# EAGLE design Round_Paws (EAGLE 9.6.0)
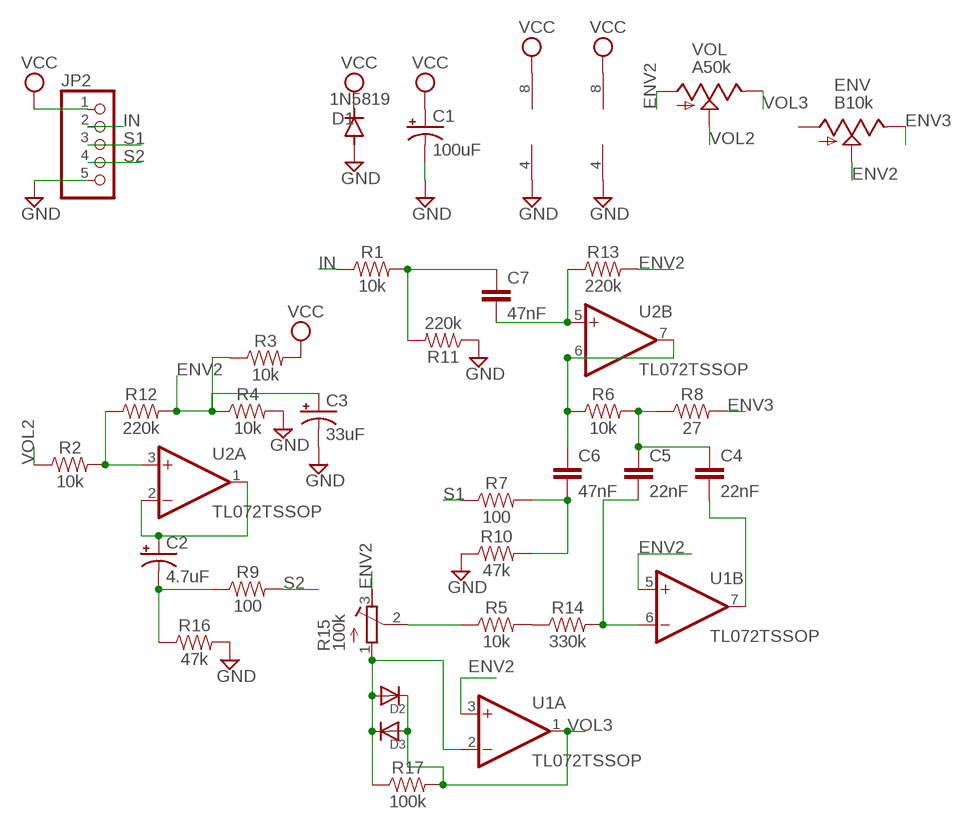
[diagram p0: schematic, sheet 1]

## Parts
C1  100uF  CAP_SMD+THRUPAN_B  [PAN_B_SMD+THRU]
C2  4.7uF  CAP_SMD+THRUPAN_B  [PAN_B_SMD+THRU]
C3  33uF  CAP_SMD+THRUPAN_B  [PAN_B_SMD+THRU]
C4  22nF  22NF/22,000PF-0603-50V-10%  [0603]
C5  22nF  22NF/22,000PF-0603-50V-10%  [0603]
C6  47nF  47NF-0603-25V-5%  [0603]
C7  47nF  47NF-0603-25V-5%  [0603]
D1  1N5819  DIODE-SOD123  [SOD123]
D2  DIODESOD-123  [SOD-123]
D3  DIODESOD-123  [SOD-123]
ENV  B10k  9MM_SNAP-IN_POT_  [9MM_SNAP-IN_POT]
JP2  PINHD-1X5  [1X05]
R1  10k  10KOHM-0603-1/10W-1%  [0603]
R2  10k  10KOHM-0603-1/10W-1%  [0603]
R3  10k  10KOHM-0603-1/10W-1%  [0603]
R4  10k  10KOHM-0603-1/10W-1%  [0603]
R5  10k  10KOHM-0603-1/10W-1%  [0603]
R6  10k  10KOHM-0603-1/10W-1%  [0603]
R7  100  100OHM-0603-1/4W-5%  [0603]
R8  27  27OHM-0603-1/10W-1%  [0603]
R9  100  100OHM-0603-1/4W-5%  [0603]
R10  47k  47KOHM-0603-1/10W-1%  [0603]
R11  220k  220KOHM-0603-1/10W-1%  [0603]
R12  220k  220KOHM-0603-1/10W-1%  [0603]
R13  220k  220KOHM-0603-1/10W-1%  [0603]
R14  330k  330KOHM-0603-1/10W-1%  [0603]
R15  100k  R-TRIMM3296W  [RTRIM3296W]
R16  47k  47KOHM-0603-1/10W-1%  [0603]
R17  100k  100KOHM-0603-1/10W-1%  [0603]
U1  TL072TSSOP  [TSSOP-8]
U2  TL072TSSOP  [TSSOP-8]
VOL  A50k  9MM_SNAP-IN_POT_  [9MM_SNAP-IN_POT]

## Nets
ENV2: C3.+ C3.++(+) ENV.2(S) R3.1 R4.1 R12.2 R13.2 R15.3(E) U1.3(A:+IN) U1.5(B:+IN) VOL.1(A)
ENV3: ENV.3(E) R8.2
GND: C1.- C1.--(-) C3.- C3.--(-) D1.A JP2.5 R4.2 R10.1 R11.1 R16.2 U1.4(P:V-) U2.4(P:V-)
IN: JP2.2 R1.1
N$1: C7.1 R1.2 R11.2
N$2: C7.2 R13.1 U2.5(B:+IN)
N$3: C6.1 R6.1 U2.6(B:-IN) U2.7(B:OUT)
N$4: C4.1 C5.1 R6.2 R8.1
N$5: C6.2 R7.2 R10.2
N$6: C5.2 R14.2 U1.6(B:-IN)
N$7: R5.2 R14.1
N$8: R5.1 R15.2(S)
N$9: D2.A D3.C R15.1(A) R17.1 U1.2(A:-IN)
N$10: C4.2 U1.7(B:OUT)
N$11: R2.2 R12.1 U2.3(A:+IN)
N$12: C2.+ C2.++(+) U2.1(A:OUT) U2.2(A:-IN)
N$13: C2.- C2.--(-) R9.1 R16.1
S1: JP2.3 R7.1
S2: JP2.4 R9.2
VCC: C1.+ C1.++(+) D1.C JP2.1 R3.2 U1.8(P:V+) U2.8(P:V+)
VOL2: R2.1 VOL.2(S)
VOL3: D2.C D3.A R17.2 U1.1(A:OUT) VOL.3(E)
Unconnected: ENV.1(A)

## Library data of the parts
C1-C3 = MusicThingModular:CAP_SMD+THRU
C4 C5 = SparkFun-Capacitors:22NF/22,000PF: 0.022uF/22nF/22,000pF ceramic capacitors A capacitor is a passive two-terminal electrical component used to store electrical energy temporarily in an electric field.; PROD_ID: CAP-07885
C6 C7 = SparkFun-Capacitors:47NF: 47nF ceramic capacitors A capacitor is a passive two-terminal electrical component used to store electrical energy temporarily in an electric field.; PROD_ID: CAP-08605
D1 = diode:DIODE-: DIODE
D2 D3 = adafruit:DIODE: Diode SMADIODE - SMA Surface Mount Package 20V 1A Schottky Diode Digikey: 641-1014-6-ND DO-1N4148 - Through Hole Small Current Diode SOD-123 20V 1 A (.5mV Vf) Schottky Diode - Digikey: MBRX120TPMSCT-ND SOD-323 10V 570mA (.38mV Vf, 3ns) Schottky Diode - Digikey: ZLLS410CT-ND SOD-523 30V 30mA Schottky Diode (RB751S-40TE61) - Digikey: RB751S-40TE61CT-ND SOT23-R/W - SOT23 Package (R = Solder Paste/Reflow Ovens, W = Hand-Soldering) BAT54Film 40V 300mA - Digikey: 497-7162-1-ND
ENV VOL = MusicThingModular:9MM_SNAP-IN_POT: 9mm vertical snap-in pot, Alpha / Panasonic style
JP2 = pinhead:PINHD-1X5: PIN HEADER
R1-R6 = SparkFun-Resistors:10KOHM: 10kΩ resistor A resistor is a passive two-terminal electrical component that implements electrical resistance as a circuit element. Resistors act to reduce current flow, and, at the same time, act to lower voltage levels within circuits. - Wikipedia; PROD_ID: RES-00824
R7 R9 = SparkFun-Resistors:100OHM: 100Ω resistor A resistor is a passive two-terminal electrical component that implements electrical resistance as a circuit element. Resistors act to reduce current flow, and, at the same time, act to lower voltage levels within circuits. - Wikipedia; PROD_ID: RES-12438
R8 = SparkFun-Resistors:27OHM: 27Ω resistor A resistor is a passive two-terminal electrical component that implements electrical resistance as a circuit element. Resistors act to reduce current flow, and, at the same time, act to lower voltage levels within circuits. - Wikipedia; PROD_ID: RES-09334
R10 R16 = SparkFun-Resistors:47KOHM: 47kΩ resistor A resistor is a passive two-terminal electrical component that implements electrical resistance as a circuit element. Resistors act to reduce current flow, and, at the same time, act to lower voltage levels within circuits. - Wikipedia; PROD_ID: RES-07871
R11-R13 = SparkFun-Resistors:220KOHM: 220kΩ resistor A resistor is a passive two-terminal electrical component that implements electrical resistance as a circuit element. Resistors act to reduce current flow, and, at the same time, act to lower voltage levels within circuits. - Wikipedia; PROD_ID: RES-08969
R14 = SparkFun-Resistors:330KOHM: 330kΩ resistor A resistor is a passive two-terminal electrical component that implements electrical resistance as a circuit element. Resistors act to reduce current flow, and, at the same time, act to lower voltage levels within circuits. - Wikipedia; PROD_ID: RES-08968
R15 = resistor:R-TRIMM: Trimm resistor
R17 = SparkFun-Resistors:100KOHM: 100kΩ resistor A resistor is a passive two-terminal electrical component that implements electrical resistance as a circuit element. Resistors act to reduce current flow, and, at the same time, act to lower voltage levels within circuits. - Wikipedia; PROD_ID: RES-07828
U1 U2 = MusicThingModular:TL072: Generic Dual Op Amp

## Board
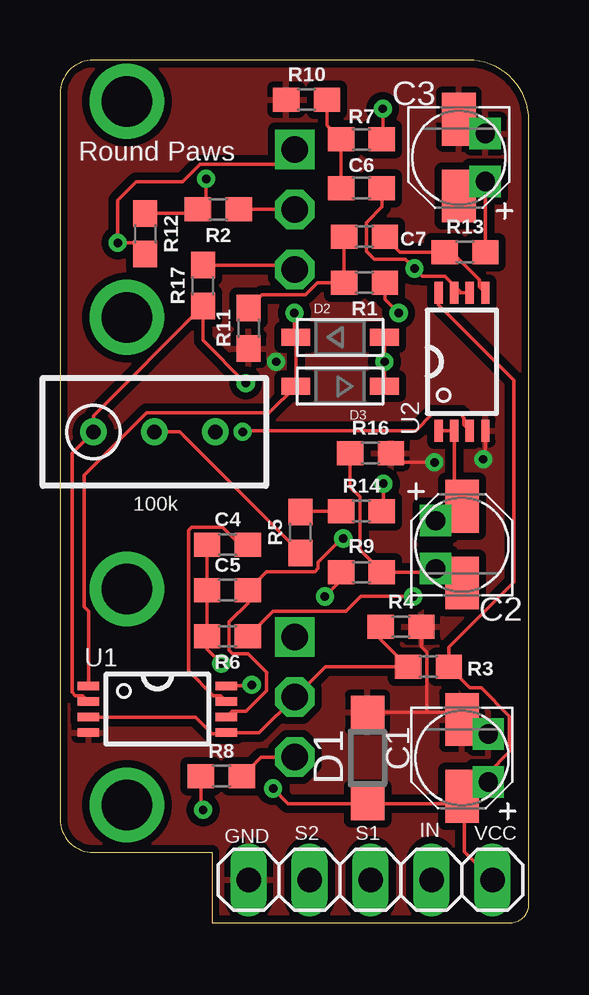
[diagram p1: board, top side]
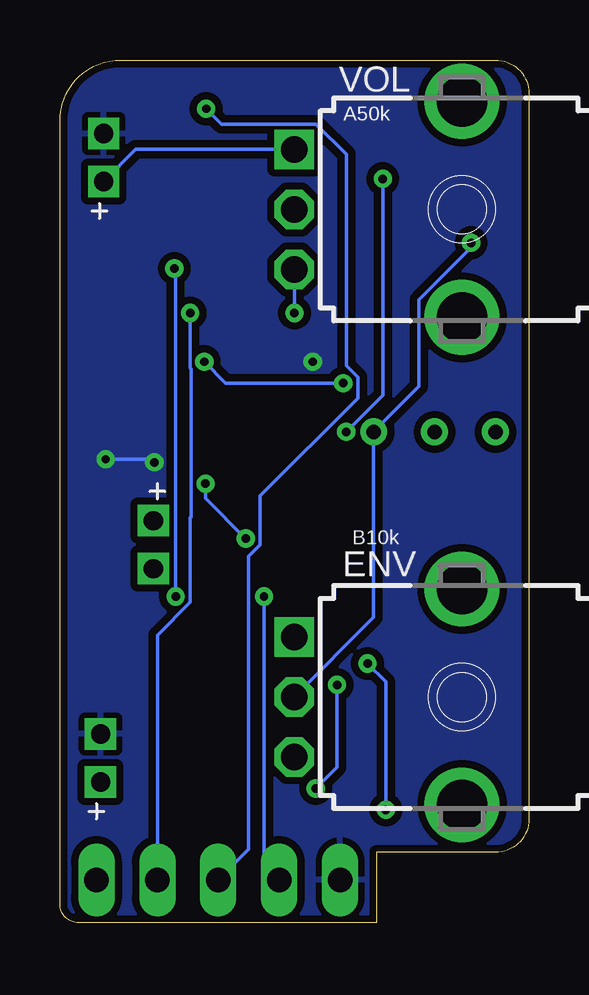
[diagram p2: board, bottom side, seen from below]

Size 19.56 x 35.94 mm. Coordinates in mm from the lower left corner, seen from the top.
Outline: 6.35,0 18.8,0 arc90 19.56,0.76 19.56,33.4 arc90 17.02,35.94 1.4,35.94 arc90 0,34.54 0,4.32 arc90 1.4,2.92 6.35,2.92 6.35,0
Copper layers (1*16): Top 0.035mm / dielectric 1.5mm / Bottom 0.035mm
Design rules "default *": minimum track width 6mil, minimum drill 0.35mm, track to track 6mil, track to pad 6mil, pad to pad 6mil, via to via 6mil, smd to smd 6mil, copper to edge 6mil, drill to drill 6mil, minimum pad ring 10mil, minimum via ring 8mil, stop-mask expansion 4mil, vias tented up to drill 0mil, thermal gap 10mil

### Footprints (pad centres in the part's own frame; a part is rotated, then mirrored left to right if it is on the bottom)
PAN_B_SMD+THRU = smd 2.2 x 1.4: + 1.6,0; - -1.6,0 | drill 0.8 pad 0.9 square: ++ 1,1.1; -- -1,1.1
0603 = smd 1.1 x 1: 1 -0.85,0; 2 0.85,0
SOD123 = smd 1.4 x 1.4: A 1.9,0; C -1.9,0
SOD-123 = smd 1.2 x 0.7: A 1.85,0; C -1.85,0
9MM_SNAP-IN_POT = drill 1.1 square: 1 -2.5,-7 | drill 1.1 octagon: 2 0,-7; 3 2.5,-7 | drill 2.1 pad 2.794: CHASSIS1 -4.5,0; CHASSIS2 4.5,0
1X05 = drill 1.016 long: 1 -5.08,0; 2 -2.54,0; 3 0,0; 4 2.54,0; 5 5.08,0
RTRIM3296W = drill 0.61: 1 0,-2.54; 2 0,0; 3 0,2.54
TSSOP-8 = smd 0.9 x 0.35: 1 -2.875,0.975; 2 -2.875,0.325; 3 -2.875,-0.325; 4 -2.875,-0.975; 5 2.875,-0.975; 6 2.875,-0.325; 7 2.875,0.325; 8 2.875,0.975

### Placement (x,y rotation side)
C1  16.76,6.86 270 top
C2  16.76,15.75 90 top
C3  16.64,31.88 270 top
C4  6.99,15.75 0 top
C5  6.99,13.84 0 top
C6  12.57,30.61 180 top
C7  12.7,28.57 0 top
D1  12.83,6.86 90 top
D2  11.68,24.38 0 top
D3  11.68,22.35 180 top
ENV  2.79,9.4 270 bottom
JP2  12.95,1.78 180 top
R1  12.7,26.67 180 top
R2  6.6,29.72 180 top
R3  15.37,10.67 0 top
R4  14.22,12.32 0 top
R5  10.03,16.26 90 top
R6  6.99,11.94 180 top
R7  12.57,32.64 180 top
R8  6.73,6.1 0 top
R9  12.57,14.61 180 top
R10  10.29,34.29 0 top
R11  7.87,24.77 90 top
R12  3.56,28.7 270 top
R13  16.89,27.94 0 top
R14  12.57,17.14 0 top
R15  3.94,20.45 270 top
R16  12.95,19.56 0 top
R17  5.97,26.54 90 top
U1  4.06,8.89 0 top
U2  16.76,23.37 90 top
VOL  2.79,29.72 270 bottom

### Tracks (layer width: path | path; a pad name or v marks a point on that pad's centre or on a via)
ENV2  (via drill 0.35)
  Top 0.152: R13.2 C3.++ 17.14,30.28 C3.+ | U1.3 5.66,8.56 6.35,7.87 6.9,7.87 U1.5 8.31,7.92 ENV.2 11.06,10.67 R3.1 13.37,11.81 R4.1 | R12.2 3.09,28.32 v2.41,28.32 2.41,30.1 3.17,30.86 5.11,30.86 5.84,31.59 9.17,31.59 VOL.1
  Bottom 0.152: VOL.1 16.4,32.22 C3.++ | v2.41,28.32 2.41,28.13 4.58,25.96 4.58,22.34 R15.3 6.48,12.71 ENV.2
ENV3
  Top 0.152: R8.2 8.38,6.9 ENV.3
GND  (via drill 0.35)
  Top 0.152: D1.A 15.37,8.76 | 15.37,8.76 16.96,8.76 C1.-- | R4.2 15.07,11.48 15.3,11.26 15.3,8.83 15.37,8.76 | v17.65,19.3 17.74,19.39 U2.4 | v15.62,19.18 14.19,19.18 R16.2
  Bottom 0.152: v15.62,19.18 15.75,19.3 v17.65,19.3
  other vias: 9.02,23.37
  pour Top (isolate 0.305): -0.64,35.94 -0.64,3.81 3.94,-0.76 19.05,-0.76 20.32,0.51 20.32,34.42 18.03,36.7 0.13,36.7
  pour Bottom (isolate 0.305): -0.64,35.94 -0.64,3.81 4.06,-0.89 18.92,-0.89 20.32,0.51 20.32,34.29 18.03,36.58 0,36.58
IN  (via drill 0.35)
  Top 0.152: v14.12,25.4 13.55,25.98 R1.1
  Bottom 0.152: JP2.2 15.49,11.97 14.12,13.34 14.12,16.86 14.1,16.89 14.1,23.07 14.14,23.12 14.14,23.62 14.12,23.64 v14.12,25.4
N$1
  Top 0.152: C7.1 R1.2 10.74,26.67 10.23,26.16 8.42,26.16 R11.2
N$2
  Top 0.152: C7.2 14.19,27.94 R13.1 16.34,27.94 17.49,26.79 17.49,26.49 U2.5
N$3  (via drill 0.35)
  Top 0.152: C6.1 13.42,29.82 12.77,29.17 12.77,27.98 13.12,27.64 14.4,27.64 v14.79,27.25 15.12,26.92 16.06,26.92 16.74,26.24 U2.6 U2.7 | v14.73,13.59 12.54,13.59 11.94,12.98 8.88,12.98 R6.1
  Bottom 0.152: v14.73,13.59 14.73,27.2 v14.79,27.25
N$4  (via drill 0.35)
  Top 0.152: C4.1 C5.1 R6.2 6.13,11.39 v6.73,10.79 | R8.1 5.88,4.79 v5.97,4.7
  Bottom 0.152: v5.97,4.7 5.97,10.03 v6.73,10.79
N$5
  Top 0.152: C6.2 R7.2 11.14,33.23 R10.2
N$6  (via drill 0.35)
  Top 0.152: U1.6 7.18,8.81 7.76,8.81 8.61,9.65 8.61,10.39 8.64,10.41 7.84,11.21 7.19,11.21 7.06,11.34 7.06,12.53 7.83,13.31 C5.2 8.62,14.63 10.63,14.63 10.76,14.76 10.76,15.02 11.75,16 v11.81,16 | v13.49,18.29 13.49,17.21 R14.2
  Bottom 0.152: v11.81,16 13.49,17.68 v13.49,18.29
N$7
  Top 0.152: R14.1 10.07,17.14 R5.2
N$8
  Top 0.152: R5.1 4.99,20.45 R15.2
N$9  (via drill 0.35)
  Top 0.152: D2.A v13.53,23.37 D3.C | U1.2 0.94,9.46 0.64,9.46 0.51,9.6 0.51,19.56 R15.1 1.4,21.12 R17.1 5.97,24.26 v7.75,22.48
  Bottom 0.152: v7.75,22.48 12.64,22.48 v13.53,23.37
N$10
  Top 0.152: U1.7 6.69,9.46 6.39,9.46 5.36,10.5 5.36,16.34 5.49,16.48 6.78,16.48 7.51,15.75 C4.2
N$11  (via drill 0.35)
  Top 0.152: R12.1 5.59,29.55 R2.2 6.1,30.06 v6.1,30.99 | v7.62,20.45 7.67,20.49 14.84,20.49 15.52,21.17 16.71,21.17 16.84,21.04 16.84,20.74 U2.3
  Bottom 0.152: v7.62,20.45 6.1,21.97 v6.1,30.99
N$12
  Top 0.152: U2.1 U2.2 16.44,17.67 C2.+ 16.26,17.35 C2.++
N$13
  Top 0.152: R16.1 12.1,18.14 12.5,17.74 12.5,15.53 R9.1 15.52,14.61 C2.-- 16.16,14.75 C2.-
S1  (via drill 0.35)
  Top 0.152: v13.46,33.91 13.46,32.68 R7.1
  Bottom 0.152: JP2.3 11.68,3.05 11.68,15.27 11.2,15.75 11.2,17.78 7.14,21.85 7.14,22.73 7.62,23.21 7.62,32.02 8.87,33.27 12.82,33.27 v13.46,33.91
S2  (via drill 0.35)
  Top 0.152: R9.2 11.72,14.26 v11.05,13.59
  Bottom 0.152: v11.05,13.59 11.05,2.41 JP2.4
VCC  (via drill 0.35)
  Top 0.152: 16.87,5.36 C1.+ 16.46,4.96 D1.C 9.52,4.96 v8.89,5.59 | 16.87,5.36 17.36,5.86 C1.++ 17.86,6.23 18.75,7.11 18.75,8.61 17.57,9.79 17.1,9.79 R3.2 16.22,11.48 18.92,14.18 18.92,22.61 15.79,25.74 U2.8 | JP2.1 16.87,2.95 16.87,5.36 | v8,9.91 7.96,9.87 U1.8
  Bottom 0.152: v8.89,5.59 8,6.48 v8,9.91
VOL2
  Top 0.152: R2.1 VOL.2
VOL3  (via drill 0.35)
  Top 0.152: R17.2 9.62,27.39 VOL.3 | v9.78,25.4 9.78,24.44 D2.C D3.A 8.72,21.23 3.61,21.23 1.01,18.63 1.01,13.16 1.19,12.98 U1.1
  Bottom 0.152: v9.78,25.4 9.78,27.2 VOL.3

### Text on the board
tPlace: Round Paws | 100k | IN | GND | S2 | S1 | VCC
bPlace: A50k | B10k